# Altium schematic sheet sch_camera.SchDoc
size A4
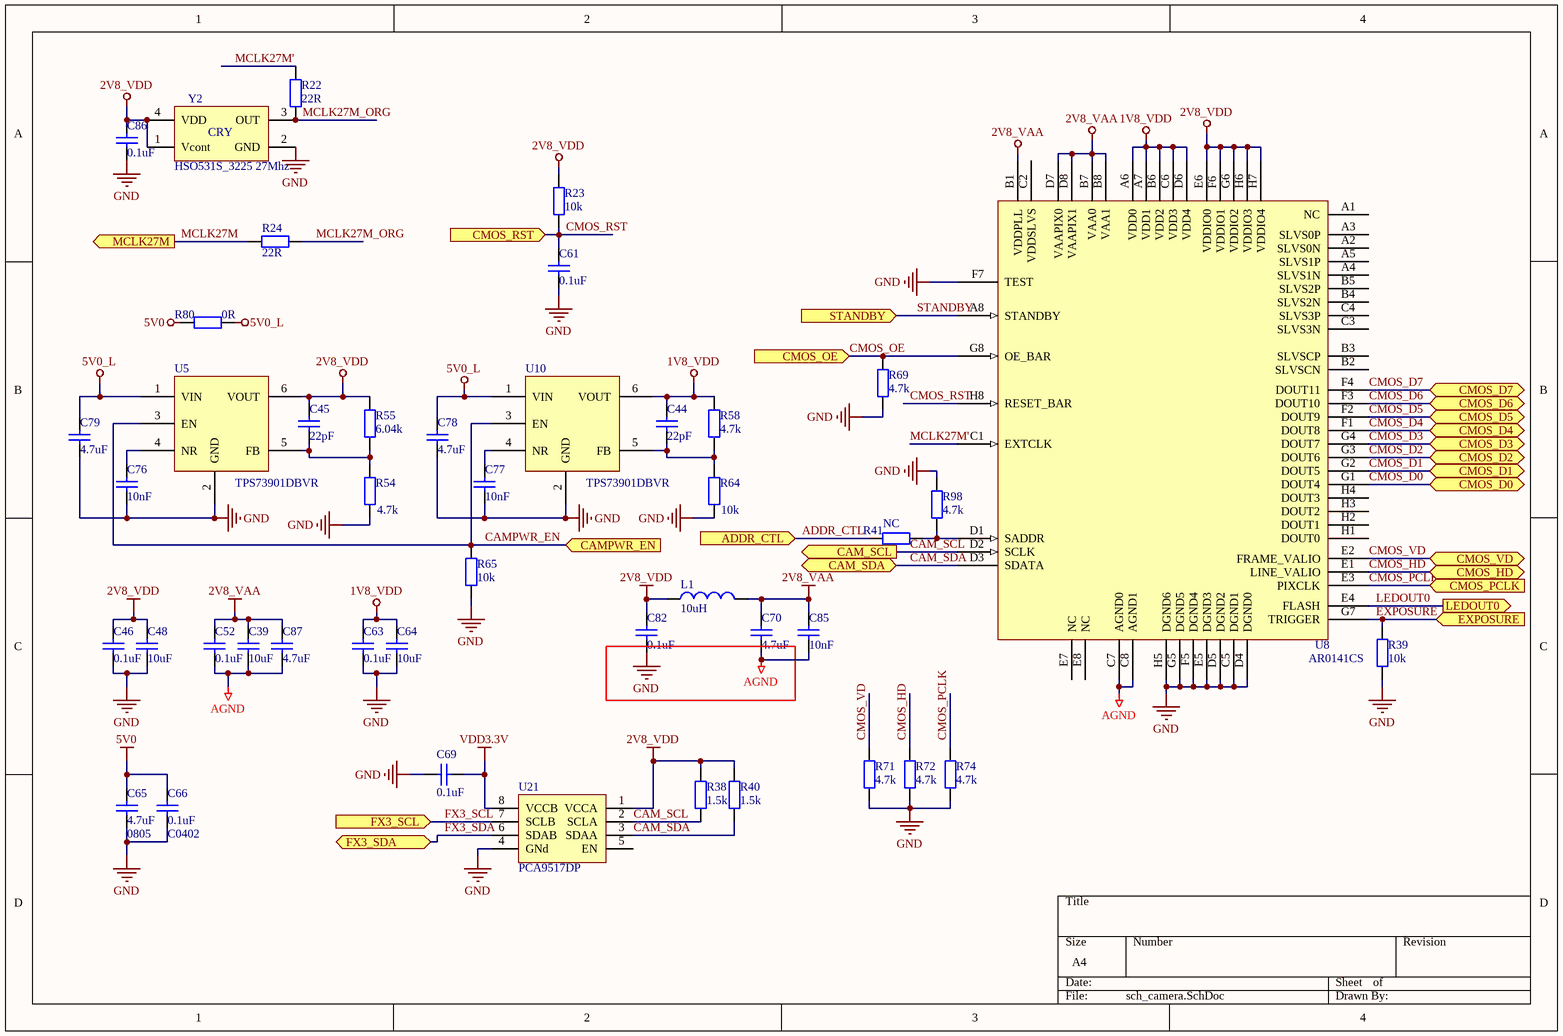
[diagram p0: sch_camera.SchDoc]

## Parts
C39  10uF  [0805C]
C44  22pF  [0402C]
C45  22pF  [0805C]
C46  0.1uF  [0402C]
C48  10uF  [0805C]
C52  0.1uF  [0402C]
C61  0.1uF  [0402C_L]
C63  0.1uF  [0402C]
C64  10uF  [0805C]
C65  4.7uF  value 0805  [0805C]
C66  0.1uF  value C0402  [0402C]
C69  0.1uF  [0402C]
C70  4.7uF  [0402C]
C76  10nF  [0402C_L]
C77  10nF  [0402C_L]
C78  value 4.7uF  [0402C_L]  (hidden comment: 1uF)
C79  value 4.7uF  [0402C_L]  (hidden comment: 1uF)
C82  0.1uF  [0402C_L]
C85  10nF  [0402C_L]
C86  0.1uF  [0402C_L]
C87  4.7uF
L1  10uH  [0805R]
R22  value 22R  [0402R_L]  (hidden comment: 0R)
R23  10K  [0402R_L]
R24  22R  [0402R]
R38  1.5K  [0402R_L]
R39  10K  [0402R_L]
R40  1.5K  [0402R_L]
R41  NC  [0402R_L]
R54  4.7K  [0402R]
R55  6.04K  [0402R]
R58  4.7K  [0402R]
R64  10K  [0402R]
R65  10K  [0402R_L]
R69  4.7K  [0402R_L]
R71  4.7K  [0402R_L]
R72  4.7K  [0402R_L]
R74  4.7K  [0402R_L]
R80  0R  [0402R]
R98  4.7K  [0402R_L]
U5  TPS73901DBVR
U8  AR0141CS
U10  TPS73901DBVR
U21  PCA9517DP
Y2  HSO531S_3225 27Mhz  [XTAL_3225]

## Ports
ADDR_CTL (in), CAM_SCL (out), CAM_SDA (bidir), CAMPWR_EN (in), CMOS_D0 (bidir), CMOS_D1 (bidir), CMOS_D2 (bidir), CMOS_D3 (bidir), CMOS_D4 (bidir), CMOS_D5 (bidir), CMOS_D6 (bidir), CMOS_D7 (bidir), CMOS_HD (bidir), CMOS_OE (in), CMOS_PCLK (in), CMOS_RST (in), CMOS_VD (bidir), EXPOSURE (in), FX3_SCL (in), FX3_SDA (bidir), LEDOUT0 (out), MCLK27M (out), STANDBY (in)

## Nets
1V8_VDD: C44.2 C63.2 C64.2 R58.2 U8.A6(VDD0) U8.A7(VDD1) U8.B6(VDD2) U8.C6(VDD3) U8.D6(VDD4) U10.6(VOUT)
2V8_VAA: C39.2 C52.2 C70.2 C85.2 C87.2 L1.2 U8.B1(VDDPLL) U8.B7(VAA0) U8.B8(VAA1) U8.D7(VAAPIX0) U8.D8(VAAPIX1)
2V8_VDD: C45.2 C46.2 C48.2 C82.2 C86.2 L1.1 R23.2 R38.2 R40.2 R55.2 U5.6(VOUT) U8.E6(VDDIO0) U8.F6(VDDIO1) U8.G6(VDDIO2) U8.H6(VDDIO3) U8.H7(VDDIO4) U21.1(VCCA) Y2.1(Vcont) Y2.4(VDD)
5V0: C65.2 C66.2 R80.1
5V0_L: C78.2 C79.2 R80.2 U5.1(VIN) U10.1(VIN)
AGND: C39.1 C52.1 C70.1 C85.1 C87.1 U8.C7(AGND0) U8.C8(AGND1)
GND: C46.1 C48.1 C61.1 C63.1 C64.1 C65.1 C66.1 C69.2 C76.1 C77.1 C78.1 C79.1 C82.1 C86.1 R39.2 R54.2 R64.2 R65.2 R69.1 R71.2 R72.2 R74.2 R98.1 U5.2(GND) U8.C5(DGND1) U8.D4(DGND0) U8.D5(DGND2) U8.E5(DGND3) U8.F5(DGND4) U8.F7(TEST) U8.G5(DGND5) U8.H5(DGND6) U10.2(GND) U21.4(GNd) Y2.2(GND)
VDD3.3V: C69.1 U21.8(VCCB)
ADDR_CTL: R41.2 ; port ADDR_CTL
CAM_SCL: R38.1 U8.D2(SCLK) U21.2(SCLA) ; port CAM_SCL
CAM_SDA: R40.1 U8.D3(SDATA) U21.3(SDAA) ; port CAM_SDA
CAMPWR_EN: R65.1 U5.3(EN) U10.3(EN) ; port CAMPWR_EN
CMOS_D0: U8.G1(DOUT4) ; port CMOS_D0
CMOS_D1: U8.G2(DOUT5) ; port CMOS_D1
CMOS_D2: U8.G3(DOUT6) ; port CMOS_D2
CMOS_D3: U8.G4(DOUT7) ; port CMOS_D3
CMOS_D4: U8.F1(DOUT8) ; port CMOS_D4
CMOS_D5: U8.F2(DOUT9) ; port CMOS_D5
CMOS_D6: U8.F3(DOUT10) ; port CMOS_D6
CMOS_D7: U8.F4(DOUT11) ; port CMOS_D7
CMOS_HD: R72.1 U8.E1(LINE_VALIO) ; port CMOS_HD
CMOS_OE: R69.2 U8.G8(OE_BAR) ; port CMOS_OE
CMOS_PCLK: R74.1 U8.E3(PIXCLK) ; port CMOS_PCLK
CMOS_RST: C61.2 R23.1 U8.H8(RESET_BAR) ; port CMOS_RST
CMOS_VD: R71.1 U8.E2(FRAME_VALIO) ; port CMOS_VD
EXPOSURE: R39.1 U8.G7(TRIGGER) ; port EXPOSURE
FX3_SCL: U21.7(SCLB) ; port FX3_SCL
FX3_SDA: U21.6(SDAB) ; port FX3_SDA
LEDOUT0: U8.E4(FLASH) ; port LEDOUT0
MCLK27M: R24.1 ; port MCLK27M
MCLK27M': R22.1 U8.C1(EXTCLK)
MCLK27M_ORG: R22.2 R24.2 Y2.3(OUT)
STANDBY: U8.A8(STANDBY) ; port STANDBY
NetC44_1: C44.1 R58.1 R64.1 U10.5(FB)
NetC45_1: C45.1 R54.1 R55.1 U5.5(FB)
NetC76_2: C76.2 U5.4(NR)
NetC77_2: C77.2 U10.4(NR)
NetR41_1: R41.1 R98.2 U8.D1(SADDR)

Not connected (* = marked no-connect by the designer): U8 A1(NC) A2(SLVS0N) A3(SLVS0P) A4(SLVS1N) A5(SLVS1P) B2(SLVSCN) B3(SLVSCP) B4(SLVS2N) B5(SLVS2P) C2(VDDSLVS) C3(SLVS3N) C4(SLVS3P) E7(NC) E8(NC) H1(DOUT0) H2(DOUT1) H3(DOUT2) H4(DOUT3); U21 5(EN)

## Library data of the parts
C39 C44-C46 C48 C52 C61 C63-C66 C70 C76-C79 C82 C85-C87 = Cap: Capacitor; Published: 8-Jun-2000; LatestRevisionDate: 17-Jul-2002; LatestRevisionNote: Re-released for DXP Platform.; Publisher: Altium Limited
  C39 C48 C64: PackageReference: RAD-0.3; Value: 10uF
  C44 C45: PackageReference: RAD-0.3; Value: 22pF
  C46 C52 C61 C63 C82 C86: Value: 0.1uF
  C65 C78 C79: PackageReference: RAD-0.3
  C70 C87: PackageReference: RAD-0.3; Value: 4.7uF
  C76 C77: PackageReference: RAD-0.3; Value: 10nF
  C85: Value: 10nF
C69 = Cap: Capacitor; Value: C0402; Published: 8-Jun-2000; LatestRevisionDate: 17-Jul-2002; LatestRevisionNote: Re-released for DXP Platform.; Publisher: Altium Limited
L1 = Inductor: Value: 330mH
R22-R24 R38-R41 R54 R55 R58 R64 R65 R69 R71 R72 R74 R80 R98 = Resistor: Published: 8-Jun-2000; LatestRevisionDate: 17-Jul-2002; LatestRevisionNote: Re-released for DXP Platform.; PackageReference: AXIAL-0.4; Publisher: Altium Limited
  R23 R39 R64 R65: Value: 10k
  R24: Value: 22R
  R38 R40: Value: 1.5k
  R41: Value: NC
  R54 R58 R69 R71 R72 R74 R98: Value: 4.7k
  R55: Value: 6.04k
  R80: Value: 0R
Y2 = CRY: 有源晶振